# Altium schematic sheet jeep_modifications.SchDoc
size A4; DocumentNumber: 2; SheetNumber: 2; SheetTotal: 3
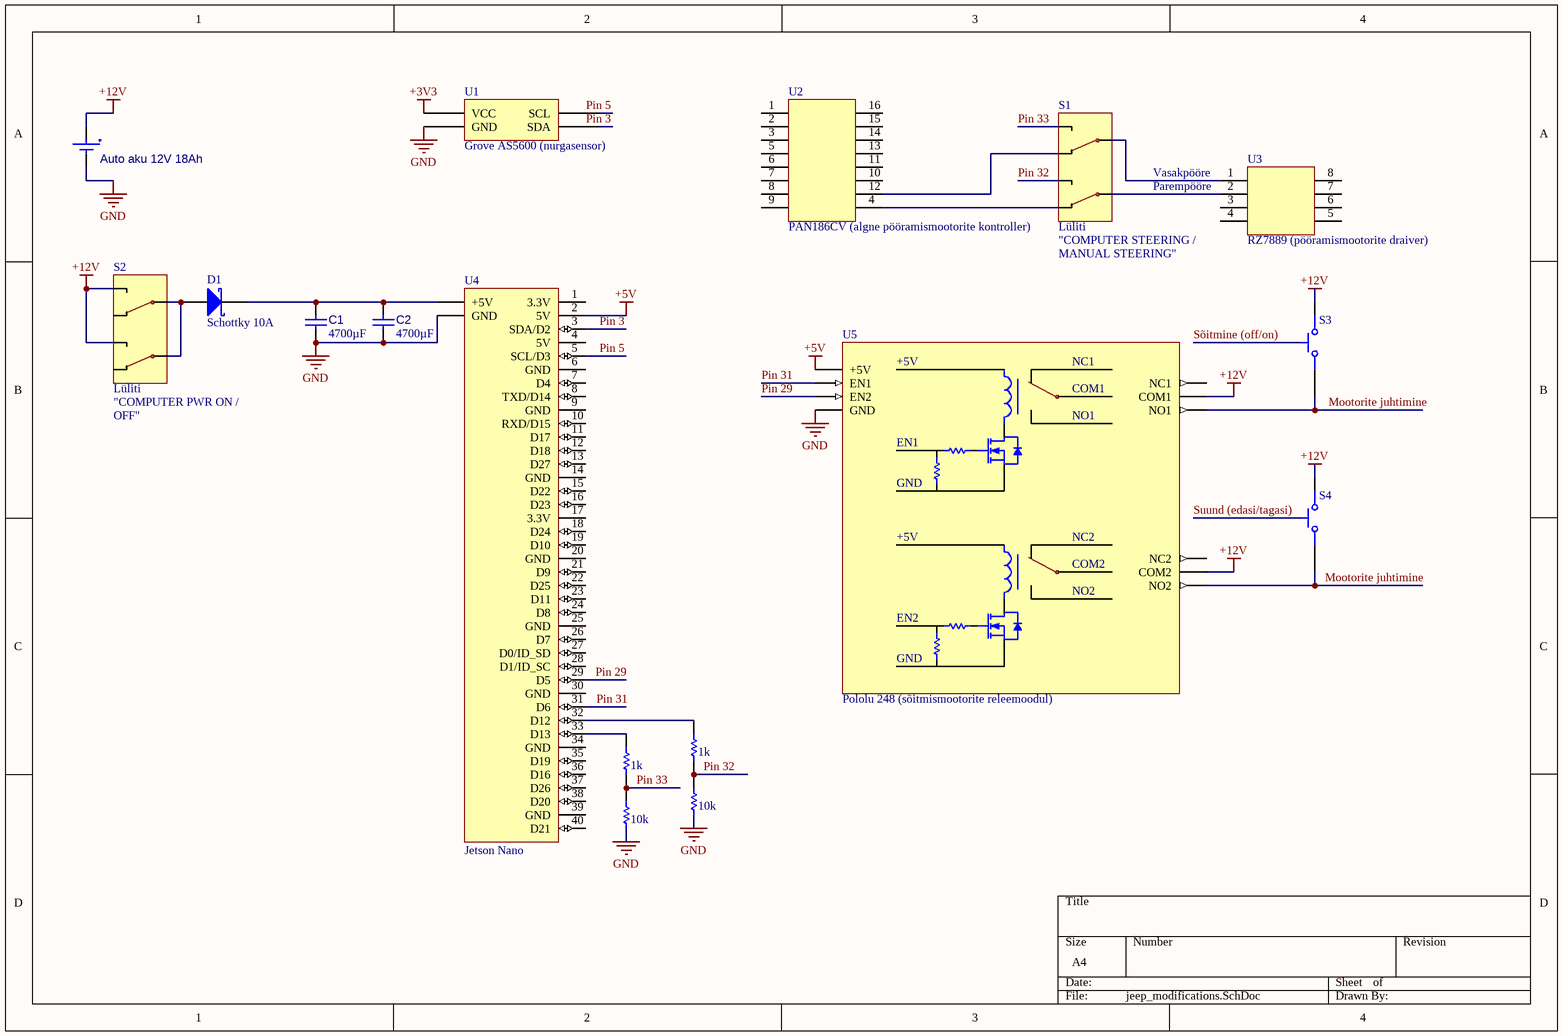
[diagram p0: jeep_modifications.SchDoc]

## Parts
Auto_aku_12V_18Ah  (no value)  [SEIK-MS621FE-FL11E-2_V]
C1  value 4700µF  [CAPC0603(1608)100_L]  (hidden comment: Capacitor 4.7µF +/-20% 10V 0603)
C2  value 4700µF  [CAPC0603(1608)100_L]  (hidden comment: Capacitor 4.7µF +/-20% 10V 0603)
D1  Schottky 10A  [JCET-SMB-2_M]
R1  1k  [RESC3116X65X40LL10T20]
R2  1k  [RESC3116X65X40LL10T20]
R3  10k  [RESC3116X65X40LL10T20]
R4  10k  [RESC3116X65X40LL10T20]
S1  Lüliti
S2  Lüliti
S3  (no value)  [OMRON-B3U-1000_V]
S4  (no value)  [OMRON-B3U-1000_V]
U1  Grove AS5600 (nurgasensor)
U2  PAN186CV (algne pööramismootorite kontroller)
U3  RZ7889 (pööramismootorite draiver)
U4  Jetson Nano
U5  Pololu 248 (sõitmismootorite releemoodul)

## Nets
+3V3: U1.1(VCC)
+5V: U4.2(5V) U5.0(+5V)
+12V: Auto_aku_12V_18Ah.1(+) S2.3 S2.4 S3.2 S4.2 U5.5(COM1) U5.8(COM2)
GND: Auto_aku_12V_18Ah.2(-) C1.1 C2.1 R3.1 R4.1 U1.2(GND) U4.?2(GND) U5.3(GND)
Mootorite juhtimine: S3.1 S4.1 U5.6(NO2) U5.9(NO1)
Pin 3: U4.3(SDA/D2)
Pin 5: U4.5(SCL/D3)
Pin 29: U4.29(D5) U5.2(EN2)
Pin 31: U4.31(D6) U5.1(EN1)
Pin 32: R1.1 R3.2 S1.4
Pin 33: R2.1 R4.2 S1.3
NetC1_2: C1.2 C2.2 D1.2(K) U4.?1(+5V)
NetD1_1: D1.1(A) S2.2(COM) S2.3(COM)
NetR1_2: R1.2 U4.32(D12)
NetR2_2: R2.2 U4.33(D13)
NetS1_1: S1.1 U2.12
NetS1_2: S1.2(COM) U3.1
NetS1_2: S1.2 U2.4  [a separate net that carries the same name]
NetS1_3: S1.3(COM) U3.2

Not connected (* = marked no-connect by the designer): S2 1; U1 3(SDA) 4(SCL); U2 1 2 3 5 6 7 8 9 10 11 13 14 15 16; U3 3 4 5 6 7 8; U4 1(3.3V) 4(5V) 6(GND) 7(D4) 8(TXD/D14) 9(GND) 10(RXD/D15) 11(D17) 12(D18) 13(D27) 14(GND) 15(D22) 16(D23) 17(3.3V) 18(D24) 19(D10) 20(GND) 21(D9) 22(D25) 23(D11) 24(D8) 25(GND) 26(D7) 27(D0/ID_SD) 28(D1/ID_SC) 30(GND) 34(GND) 35(D19) 36(D16) 37(D26) 38(D20) 39(GND) 40(D21); U5 4(NC1) 7(NC2)

## Notes on the sheet
- Vasakpööre
- (near S1) "COMPUTER STEERING /
- Parempööre
- (near S1) MANUAL STEERING"
- (near S2) "COMPUTER PWR ON /
- (near S2) OFF"
- Labels drawn without touching a wire or pin: Pin 3, Pin 5

## Library data of the parts
Auto_aku_12V_18Ah = CMP-00029-00000-1: MS Lihium Rechargeable Battery, 3 V, -20 to 60 degC, Tray; RoHS Compliant: NotApplicable; Mounting Technology: WithLeads; Pins: 2
C1 C2 = CMP-001-00076-5: Chip Capacitor, 4.7µF +/-20%, 10V, 0603, Thickness 1 mm; Tolerance: 10%; Case/Package: 0603; Voltage Rating: 10V; Pins: 2; Mounting Technology: SMT; Min Operating Temperature: -55°C; Max Operating Temperature: 85°C
D1 = CMP-004-00006-2: Schottky Barrier Rectifier, 40 V, 5 A, -55 to 150 degC, 2-Pin SMD; Manufacturer: JCET; Datasheet URL: http://wiki.seeedstudio.com/images/3/3f/0310130P1.pdf; Datasheet Version: May-13; Package Reference: SMB-2; RoHS Compliant: Unknown; Manufacturer URL: http://www.cj-elec.com/; Mounting Technology: SM; Package Description: 2-Pin Surface Mount Device, Body 4.315 x 3.62 mm; Case/Package: SMB-2
R1-R4 = CMP-2003-04964-1: Part Number: RC1206FR-10750RL; Manufacturer: Yageo
S1 S2 = CMP-011-00006-4: Slide Switch, SPDT, 500 V, -20 to 70 degC, 3-Pin THD, RoHS, Bulk
S3 S4 = CMP-011-00000-2: Tactile Switch, SPST-NO, 0.05 A, 12 V, -25 to 70 degC, 2-Pin SMD, RoHS, Tape and Reel; Manufacturer: Omron Electronic Components; IP Rating: IP40; Current Rating: 50mA; Max Contact Resistance: 100mohm; Operating Force: 153gf; Throw Configuration: SPST; Resistance: 0.1Ohm; Max Voltage Rating (DC): 12V; Contact Material: Silver; Max Current Rating: 50mA; Datasheet URL: http://www.omron.com/ecb/products/pdf/en-b3u.pdf; Mounting Technology: SM; Case/Package: B3U-1000; Packaging: TapeandReel; Package Reference: B3U-1000; Manufacturer URL: http://www.omron.com/; Datasheet Version: Jan-15; RoHS Compliant: True; Max Operating Temperature: 70°C; Contact Current Rating: 50mA; Package Quantity: 3500; Package Description: 2-Pin Surface Mount Device, Body 3 x 2.5 mm; Voltage Rating (DC): 12V; Min Operating Temperature: -25°C; Voltage Rating: 12V
U1 = CMP-010-00025-1: magnetic rotary sensor
U2 = CMP-016-00015-7
U3 = CMP-00024-00007-3
U4 = CMP-020-00024-11: Jetson Nano Developer Kit
U5 = CMP-016-00016-4: Pololu Basic 2-Channel SPDT Relay Carrier with 5VDC Relays, Terminal Blocks, and JST SH-Style Top-Entry Connector